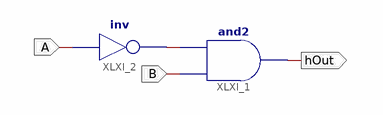
[diagram p0: schematic sheet 1]
// Xilinx ISE schematic h.sch (xa9500xl) as structural Verilog: 2 symbols, 3 ports
module h (
  input  A,
  input  B,
  output hOut
);

  wire XLXN_1;

  and XLXI_1 (hOut, B, XLXN_1);
  not XLXI_2 (XLXN_1, A);
endmodule
